# Altium schematic sheet PWR.SchDoc
size A3; SheetNumber: 5; SheetTotal: 6
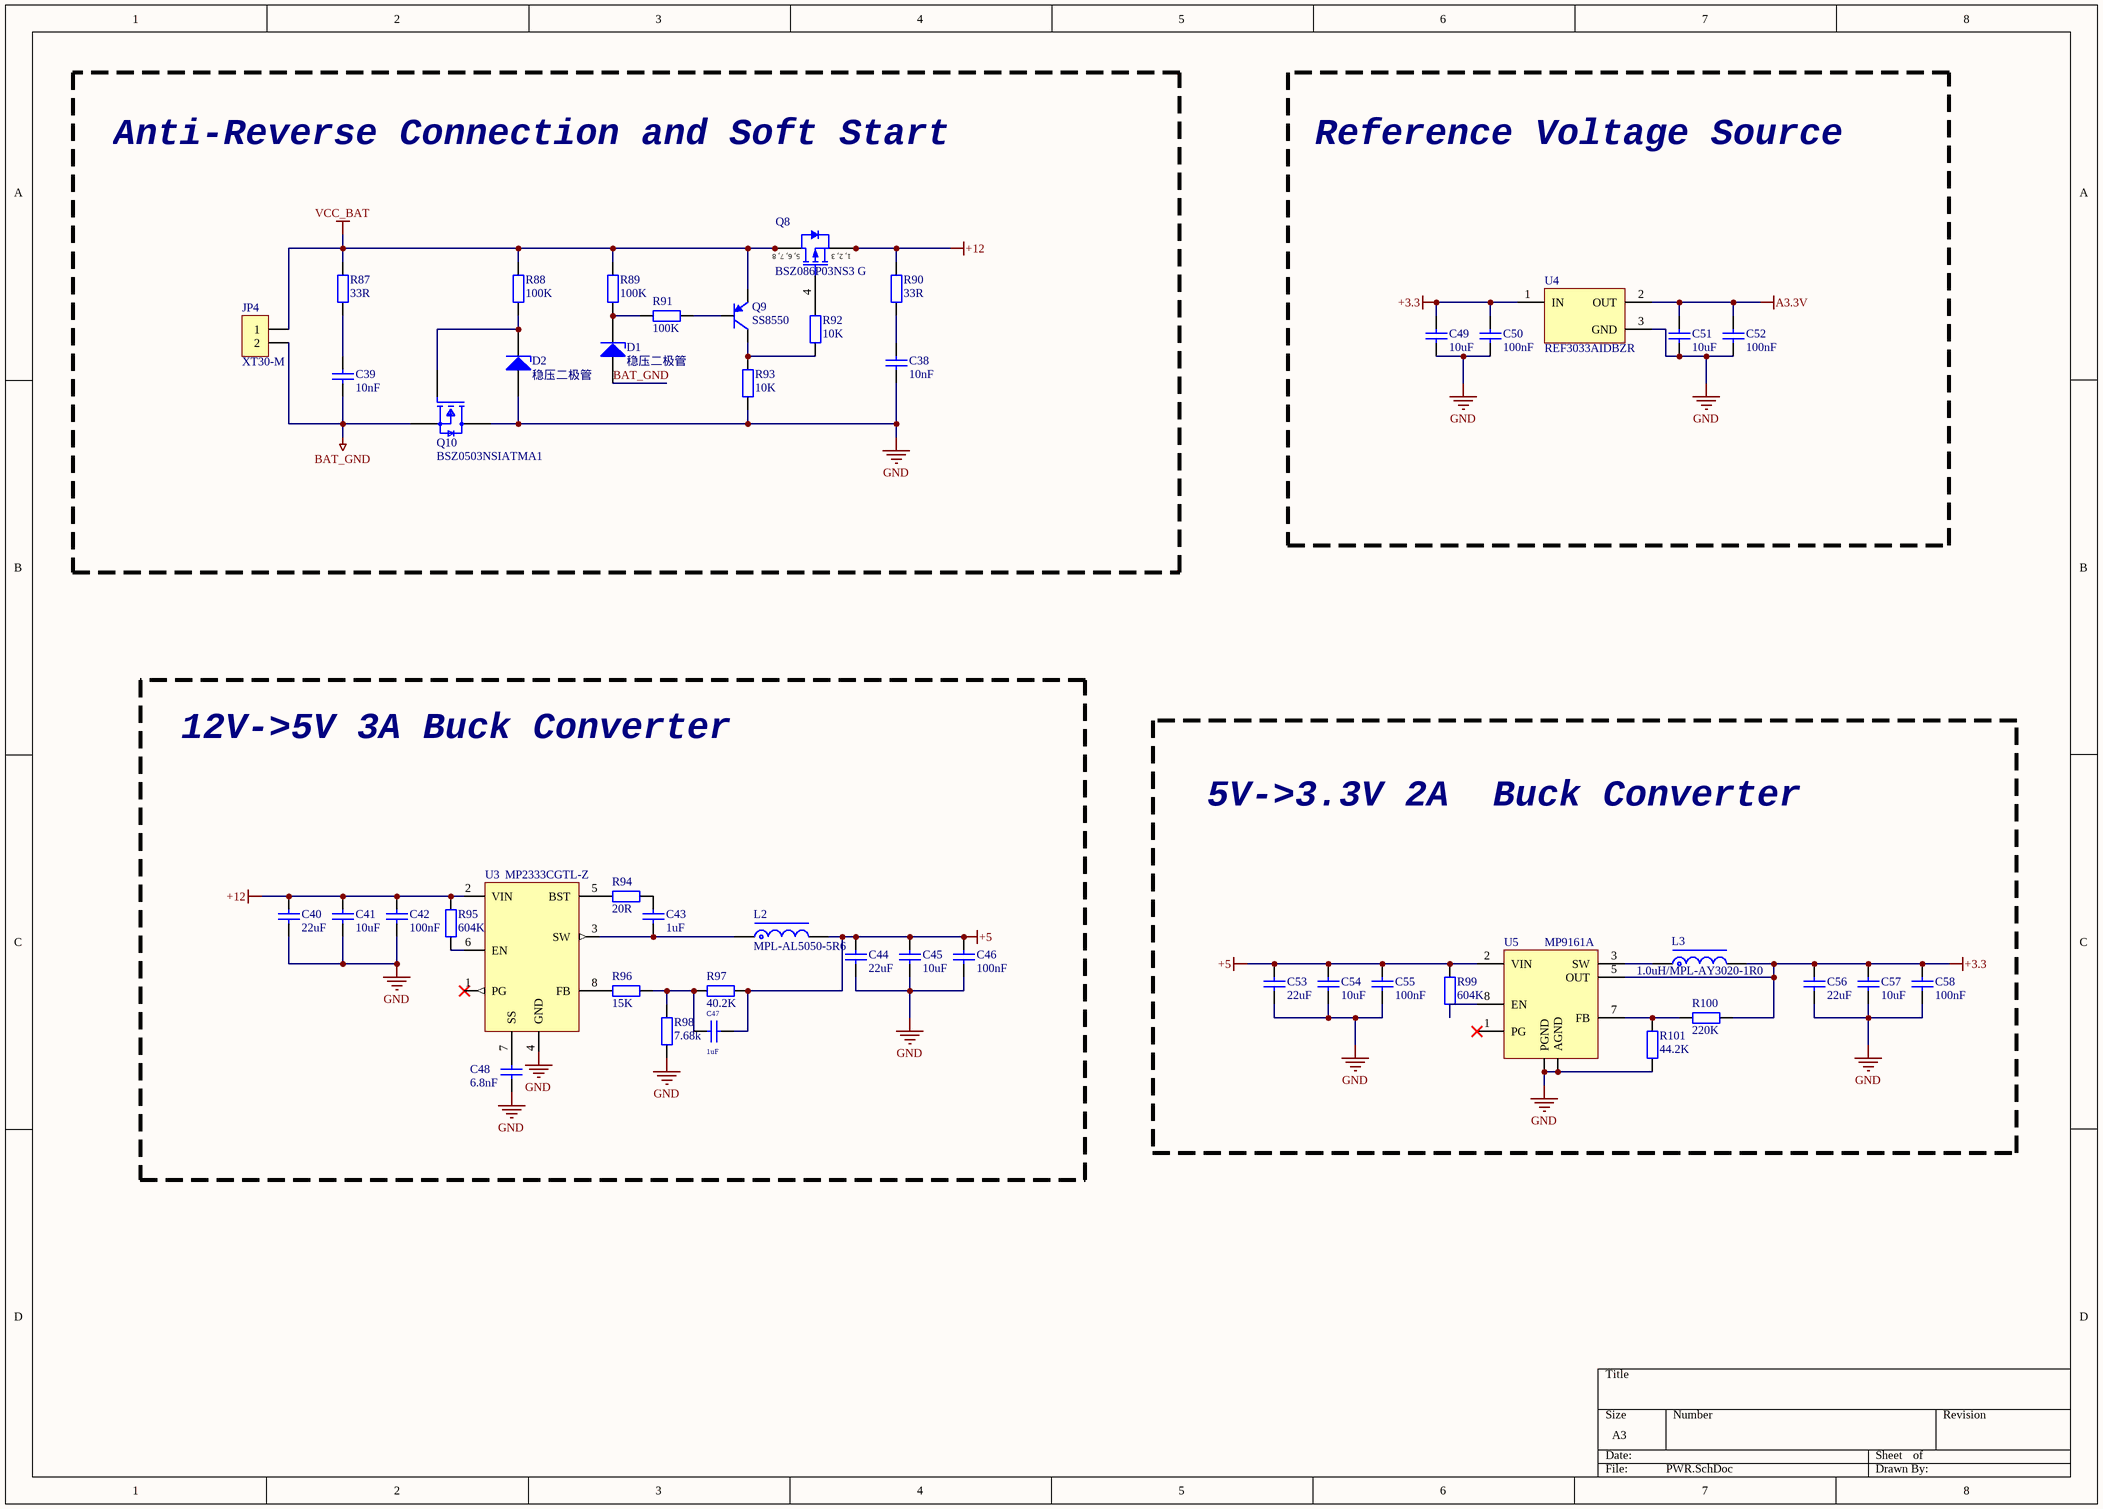
[diagram p0: PWR.SchDoc]

## Parts
C38  10nF  [C0402_M]
C39  10nF  [C0402_M]
C40  22uF  [C0402_M]
C41  10uF  [C0402_M]
C42  100nF  [C0402_M]
C43  1uF  [C0402_M]
C44  22uF  [C0402_M]
C45  10uF  [C0402_M]
C46  100nF  [C0402_M]
C47  1uF  [C0402_M]
C48  6.8nF  [C0402_M]
C49  10uF  [C0402_M]
C50  100nF  [C0402_M]
C51  10uF  [C0402_M]
C52  100nF  [C0402_M]
C53  22uF  [C0402_M]
C54  10uF  [C0402_M]
C55  100nF  [C0402_M]
C56  22uF  [C0402_M]
C57  10uF  [C0402_M]
C58  100nF  [C0402_M]
D1  稳压二极管  [SOD-523]
D2  稳压二极管  [SOD-523]
JP4  XT30-M  [XT30PB-M]
L2  MPL-AL5050-5R6  [MPL-AL5050]
L3  1.0uH/MPL-AY3020-1R0  [MPL-AY3020]
Q8  BSZ086P03NS3 G  [INF-PG-TSDSON-8-1_V]
Q9  SS8550  [SOT23-3N]
Q10  BSZ0503NSIATMA1  [FP-PG-TSDSON-8-MFG]
R87  33R  [R0402_L]
R88  100K  [R0402_L]
R89  100K  [R0402_L]
R90  33R  [R0402_L]
R91  100K  [R0402_L]
R92  10K  [R0402_L]
R93  10K  [R0402_L]
R94  20R  [R0402_L]
R95  604K  [R0402_L]
R96  15K  [R0402_L]
R97  40.2K  [R0402_L]
R98  7.68k  [R0402_L]
R99  604K  [R0402_L]
R100  220K  [R0402_L]
R101  44.2K  [R0402_L]
U3  MP2333CGTL-Z  [SOT583_MP2333C_MNP]
U4  REF3033AIDBZR  [DBZ0003A_N]
U5  MP9161A  [SOT23-8]

## Blocks framed on the sheet
Anti-Reverse Connection and Soft Start: C38 C39 D1 D2 JP4 Q8-Q10 R87-R93
Reference Voltage Source: C49-C52 U4
12V->5V 3A Buck Converter: C40-C48 L2 R94-R98 U3
5V->3.3V 2A  Buck Converter: C53-C58 L3 R99-R101 U5

## Nets
+3.3: C49.2 C50.2 C56.2 C57.2 C58.2 L3.2 R100.2 U4.1(IN) U5.5(OUT)
+5: C44.2 C45.2 C46.2 C47.1 C53.2 C54.2 C55.2 L2.2 R97.2 R99.2 U5.2(VIN)
+12: C40.2 C41.2 C42.2 Q8.1(SOURCE) Q8.2(SOURCE) Q8.3(SOURCE) R90.2 R95.2 U3.2(VIN)
A3.3V: C51.2 C52.2 U4.2(OUT)
BAT_GND: C39.1 D1.1(A) JP4.2 Q10.1-2-3(S)
GND: C38.1 C40.1 C41.1 C42.1 C44.1 C45.1 C46.1 C48.2 C49.1 C50.1 C51.1 C52.1 C53.1 C54.1 C55.1 C56.1 C57.1 C58.1 D2.1(A) Q10.5-6-7-8(D) R93.2 R98.2 R101.2 U3.4(GND) U4.3(GND) U5.4(PGND) U5.6(AGND)
VCC_BAT: JP4.1 Q8.5(DRAIN) Q8.6(DRAIN) Q8.7(DRAIN) Q8.8(DRAIN) Q9.2(E) R87.2 R88.2 R89.2
NetC38_2: C38.2 R90.1
NetC39_2: C39.2 R87.1
NetC43_1: C43.1 L2.1 U3.3(SW)
NetC43_2: C43.2 R94.1
NetC47_2: C47.2 R96.1 R97.1 R98.1
NetC48_1: C48.1 U3.7(SS)
NetD1_2: D1.2(K) R89.1 R91.2
NetD2_2: D2.2(K) Q10.4(G) R88.1
NetL3_1: L3.1 U5.3(SW)
NetQ8_4: Q8.4(GATE) R92.1
NetQ9_1: Q9.1(B) R91.1
NetQ9_3: Q9.3(C) R92.2 R93.1
NetR94_2: R94.2 U3.5(BST)
NetR95_1: R95.1 U3.6(EN)
NetR96_2: R96.2 U3.8(FB)
NetR99_1: R99.1 U5.8(EN)
NetR100_1: R100.1 R101.1 U5.7(FB)

Not connected (* = marked no-connect by the designer): U3 1(PG)*; U5 1(PG)*

## Notes on the sheet
- (in symbol CMP-1099-00063-1) 5, 6, 7, 8; 1, 2, 3

## Library data of the parts
C38-C58 = C: 贴片电容/MLCC电容; BOM名称: 无极性贴片电容; 当前库版本V2023.5.31 @淘宝卖家:黄晶宝石: 最新版本发布https://item.taobao.com/item.htm?id=566775463719
D1 D2 = 稳压二极管: Zener Diode; 当前库版本V2023.5.31 @淘宝卖家:黄晶宝石: 最新版本发布https://shop463601444.taobao.com
JP4 = XT30-M: XT30公头; 当前库版本V2023.5.31 @淘宝卖家:黄晶宝石: 最新版本发布https://shop463601444.taobao.com
L2 L3 = L-Molding Choke: 一体成型电感; 当前库版本V2023.5.31 @淘宝卖家:黄晶宝石: 最新版本发布https://item.taobao.com/item.htm?id=566775463719; BOM名称: 一体成型电感
Q8 = CMP-1099-00063-1: P-Channel OptiMOS P3 Power-Transistor, -30 V VDS, -40 A ID, -55 to 150 degC, PG-TSDSON-8-1, Reel, Green; Manufacturer: Infineon; RDS (on) (max): 8.6Â mOhm; Rth: 1.8Â K/W; QG: 43.2Â nC; VGS(th) (max): -1.9Â V; RthJC (max): 1.8 K/W; Green: TRUE; Pto t (max): 69Â W; ID (max): -40Â A; IDpuls (max): -160Â A; VDS (max): -30Â V; VGS(th) (min): -3.1Â V; ComponentLink1URL: http://www.infineon.com/; ComponentLink2URL: http://www.infineon.com/dgdl/BSZ086P03NS3+G_2.03.pdf?folderId=db3a304314dca38901154a7313d21a66&fileId=db3a30431ff9881501203d3a5e7d17a9; Mounting Technology: Surface Mount; PartNumber: BSZ086P03NS3 G; Packing: Reel; PackageVersion: Rev. 02, 09/2008; Halogen-free: TRUE; ComponentLink3URL: http://www.infineon.com/dgdl/BSZ240N12NS3+Rev2.0.pdf?folderId=db3a304313b8b5a60113cee8763b02d7&fileId=db3a30432a40a650012a42f3057a0038; PackageDescription: 8-Pin Plastic (Green) Thin Dual Small Outline Non-Leaded Package, 3.3 x 3.3 mm Body, 0.65 mm Pitch; PackageReference: PG-TSDSON-8-1; DatasheetVersion: Rev. 2.03; ComponentLink2Description: Datasheet; ComponentLink3Description: Package Specification; ComponentLink1Description: Manufacturer URL
Q9 = 8550-SMD: 高频放大-PNP型; 参数: 40V 1.5A 1W 100MHZ; 联系下单店铺卖家 免费帮你查找封装: 联系下单店铺卖家 免费技术支持; BOM名称: 高频放大-PNP型
Q10 = CMP-00066-1: BSZ0503NSI series 30V 40A 3.4 mOhm N-Ch S3O8 OptiMOS 5; Max Power Dissipation: 36W; Rds On Max: 3.4mR; Input Capacitance: 1.3nF; Mounting Technology: Surface Mount; Max Operating Temperature: 150°C; Halogen Free: Halogen Free; Series: OptiMOS™; Packaging: Tape and Reel; Pins: 8; Min Operating Temperature: -55°C; Drain to Source Voltage (Vdss): 30V; Lead Free: Contains Lead; Max Dual Supply Voltage: 30V; RoHS Compliant: Yes
R87-R101 = CMP-005-000000-2: 贴片电阻0; 联系下单店铺卖家 免费帮你查找封装: 联系下单店铺卖家 免费技术支持; BOM名称: 贴片电阻; Source: 0.1 - 电阻-电容-电感-保险丝-晶振-晶体-磁珠-电位器-法拉电容-馈通电容.SchLib; Design Item ID: R
U3 = CMP-00056-3: Switching Voltage Regulators 3A, 18V, 650kHz, Force CCM, Synchronous Step-Down C
U4 = CMP-0367-00170-2: 3.3 V, 50 ppm / degC, 50 uA Series (Bandgap) Voltage Reference, -40 to 125 degC, 3-pin SOT-23 (DBZ), Green (RoHS & no Sb/Br); Manufacturer: Texas Instruments; SubFamily: Series Voltage Reference; VO(V): 3.3; Rating: Catalog; VI(Max)(V): 5.5; Initial Accuracy @ 25/deg C(%): 0.2; VI(Min)(V): 3.301; Iq(Max)(uA): 50; Temp Coeff(Typ)(ppm/ degree C): 20; Eco-Plan: Green (RoHS & no Sb/Br); DatasheetVersion: SBVS032F; ComponentLink2URL: http://www.ti.com/general/docs/lit/getliterature.tsp?genericPartNumber=REF3033&fileType=pdf; Mounting Technology: Surface Mount; Code_JEDEC: TO-236; PackageDescription: 3-Pin Plastic Small Outline, Body 2.92 x 1.3 mm, Pitch 0.95 mm; PackageReference: DBZ0003A; ComponentLink1URL: http://www.ti.com/; ComponentLink3URL: http://www.ti.com/litv/pdf/mpds108a; PackageVersion: 4203227/B; ComponentLink3Description: Package Specification; PartNumber: REF3033AIDBZR; ComponentLink2Description: Datasheet; ComponentLink1Description: Manufacturer URL; Temp Coeff(Max)(ppm/ degree C): 50
U5 = CMP-00064-1